# Altium schematic sheet S03_Power_Management.SchDoc
size A4
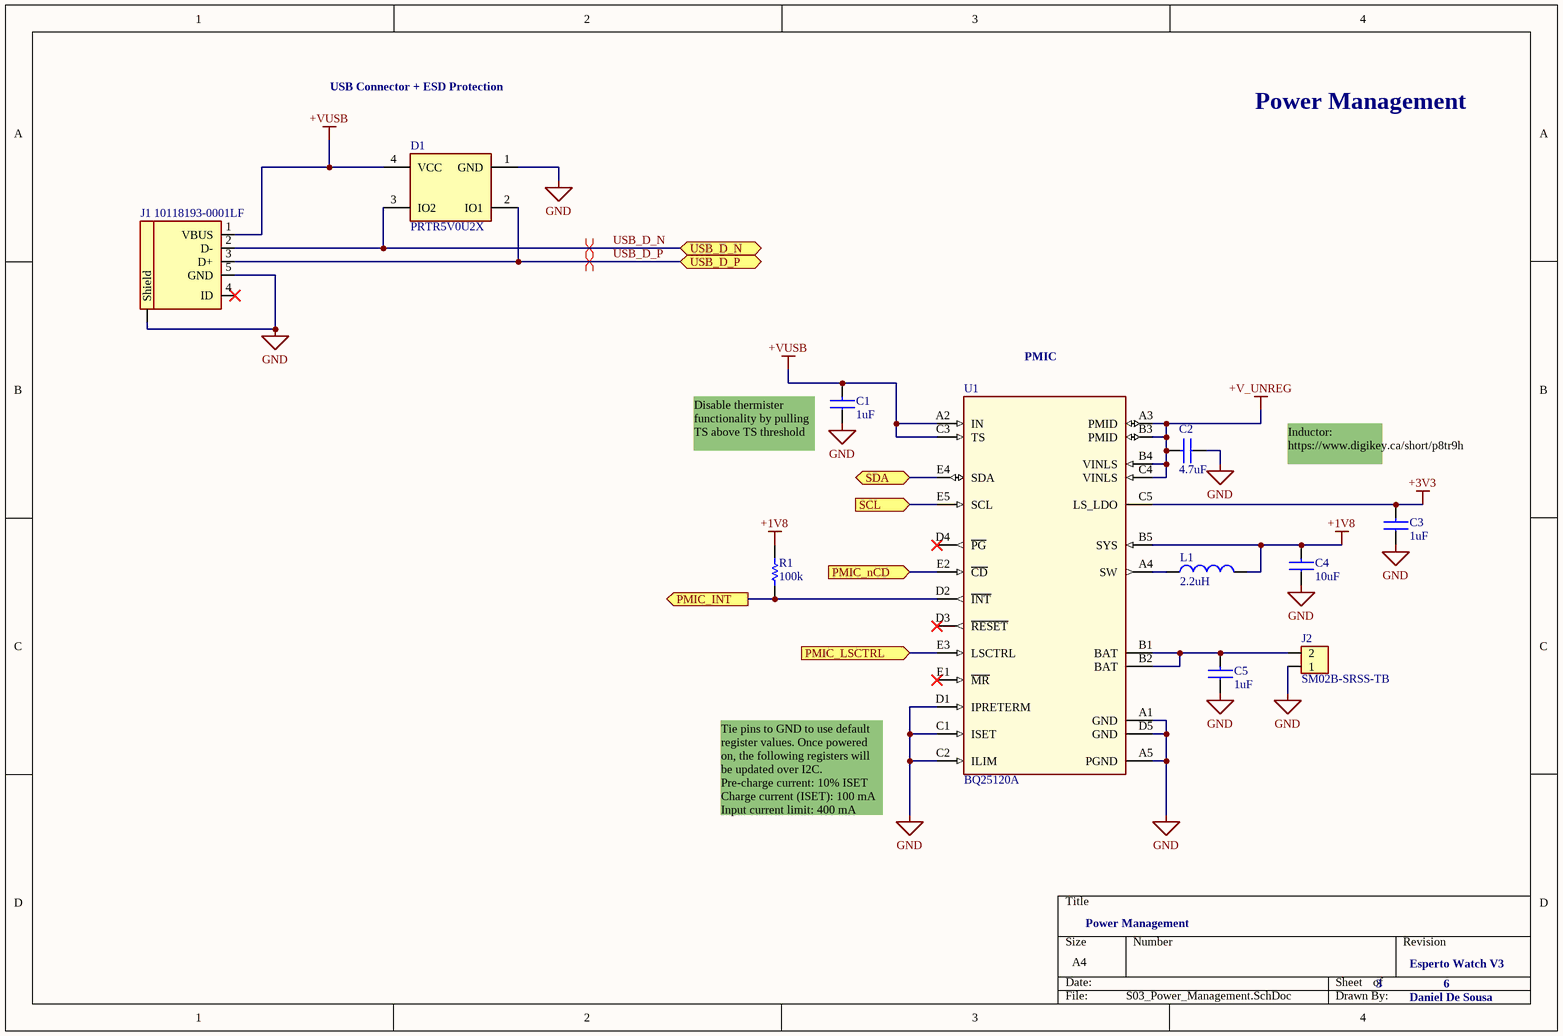
[diagram p0: S03_Power_Management.SchDoc]

## Parts
C1  1uF  [CC_1005_0402_N]
C2  4.7uF  [CC_1005_0402_N]
C3  1uF  [CC_1005_0402_N]
C4  10uF  [CC_1005_0402_N]
C5  1uF  [CC_1005_0402_N]
D1  PRTR5V0U2X  [PRTR5V0U2X]
J1  10118193-0001LF  [CONN_USB_MICRO_B]
J2  SM02B-SRSS-TB  [SM02B-SRSS-TB]
L1  2.2uH  [IND_1608_0603_N]
R1  100k  [RC_1005_0402_N]
U1  BQ25120A  [BQ25120A]

## Ports
PMIC_INT (out), PMIC_LSCTRL (in), PMIC_nCD (in), SCL (in), SDA (bidir), USB_D_N (bidir), USB_D_P (bidir)

## Nets
+1V8: C4.2 L1.2 R1.2 U1.B5(SYS)
+3V3: C3.2 U1.C5(LS_LDO)
+V_UNREG: C2.2 U1.A3(PMID) U1.B3(PMID) U1.B4(VINLS) U1.C4(VINLS)
+VUSB: C1.2 D1.4(VCC) J1.1(VBUS) U1.A2(IN) U1.C3(TS)
GND: C1.1 C2.1 C3.1 C4.1 C5.1 D1.1(GND) J1.5(GND) J1.6(Shield) J2.1 U1.A1(GND) U1.A5(PGND) U1.C1(ISET) U1.C2(ILIM) U1.D1(IPRETERM) U1.D5(GND)
PMIC_INT: R1.1 U1.D2(~{INT}) ; port PMIC_INT
PMIC_LSCTRL: U1.E3(LSCTRL) ; port PMIC_LSCTRL
PMIC_nCD: U1.E2(~{CD}) ; port PMIC_nCD
SCL: U1.E5(SCL) ; port SCL
SDA: U1.E4(SDA) ; port SDA
USB_D_N: D1.3(IO2) J1.2(D-) ; port USB_D_N
USB_D_P: D1.2(IO1) J1.3(D+) ; port USB_D_P
NetC5_2: C5.2 J2.2 U1.B1(BAT) U1.B2(BAT)
NetL1_1: L1.1 U1.A4(SW)

Not connected (* = marked no-connect by the designer): J1 4(ID)*; U1 D3(~{RESET})* D4(~{PG})* E1(~{MR})*

## Layout directives
differential pair: USB_D_N, USB_D_P

## Notes on the sheet
- USB Connector + ESD Protection
- Power Management
- PMIC
- (near C1) Disable thermister functionality by pulling TS above TS threshold
- Inductor: https://www.digikey.ca/short/p8tr9h
- Tie pins to GND to use default register values. Once powered on, the following registers will be updated over I2C.
  Pre-charge current: 10% ISET
  Charge current (ISET): 100 mA
  Input current limit: 400 mA
- 3
- Esperto Watch V3
- 6
- Daniel De Sousa

## Library data of the parts
C1-C5 = Capacitor
  C1 C3 C5: VALUE: 1uF
  C2: VALUE: 4.7uF
  C4: VALUE: 10uF
D1 = PRTR5V0U2X: Ultra low capacitance double rail-to-rail ESD protection diode; Manufacturer: NXP; 2nd source part number: 152-4157; Artikkelnr Noca: 10069015; Artikkelnr Simpro: N.A.; Part Number: PRTR5V0U2X; Manufacturer Part Number: PRTR5V0U2X; Datasheet: http://www.farnell.com/datasheets/109718.pdf; LatestRevisionDate: 2012-06-11; Publisher: Nordic Semiconductor; Published: 2012-06-11; Value: PRTR5V0U2X; Note: *; Supplier: Digi-Key; Supplier part number: 568-4140-1-ND; 2nd source Supplier: Farnell; Footprint Doc: SOT-143B
J1 = CONN_USB: MicroUSB-B-SMT; Part Number: USB-Micro-B-RA-SMD-PiP; Manufacturer: Allen Creations Corp.; Manufacturer Part Number: AJU55-BS2111-L; 2nd source part number: 609-4616-1-ND; Part number IPS: 00000007790; Artikkelnr Noca: 55029020; Artikkelnr Simpro: N.A.; Datasheet: \\hizz\pro\app9717\Datasheet\connectores\Allen Creations Corp\AJU-211.pdf; Footprint Doc: USB-Micro-B-RA-SMD-PiP; LatestRevisionDate: 2016-04-21; Pin Count: 5; Publisher: Nordic Semiconductor; Published: 2014-10-07; Value: MicroUSB-B; Note: *; Supplier: Cabcon; Supplier part number: AJU55-BS2111-L; 2nd source Supplier: Digi-Key
J2 = SM02B-SRSS-TB: 1.0mm pitch connector side entry SMD; Manufacturer: JST; Manufacturer Part Number: SM02B-SRSS-TB(LF)(SN); Part number IPS: 00000007791; Value: HDR-2, 1mm; Note: JST, Header; Artikkelnr Noca: 55010030; Artikkelnr Simpro: N.A.; Part Number: SM02B-SRSS-TB; Datasheet: http://www.jst-mfg.com/product/pdf/eng/eSH.pdf; Footprint Doc: SM02B-SRSS-TB; LatestRevisionDate: 2016-06-20; Pin Count: 2; Publisher: Nordic Semiconductor; Published: 2016-06-20; Supplier: Digi-Key; Supplier part number: 455-1802-1-ND; 2nd source Supplier: *; 2nd source part number: *
L1 = Inductor_0603: Inductor; VALUE: 2.2uH
R1 = Resistor: Value: 100k
U1 = BQ25120A: Battery Charge Management Solution; Manufacturer_Part_Number: BQ25120YFPR; Alternate_PartNumber: BQ25120YFPT; Vendor: Texas Instruments; Built_By: Texas_Instrument_Team; CompType: IC; Copyright: Copyright (C) 2018 Accelerated Designs. All rights reserved; RefDes: RefDes; Type: DEV; Value: Value; Application_BuildNumber: *; PartNumber: BQ25120YFPR; PackageReference: YFP0025BABD; MountType: SMT; RoHS: Y; Manufacturer: Texas Instruments